# Altium schematic sheet frontend.SchDoc
size B
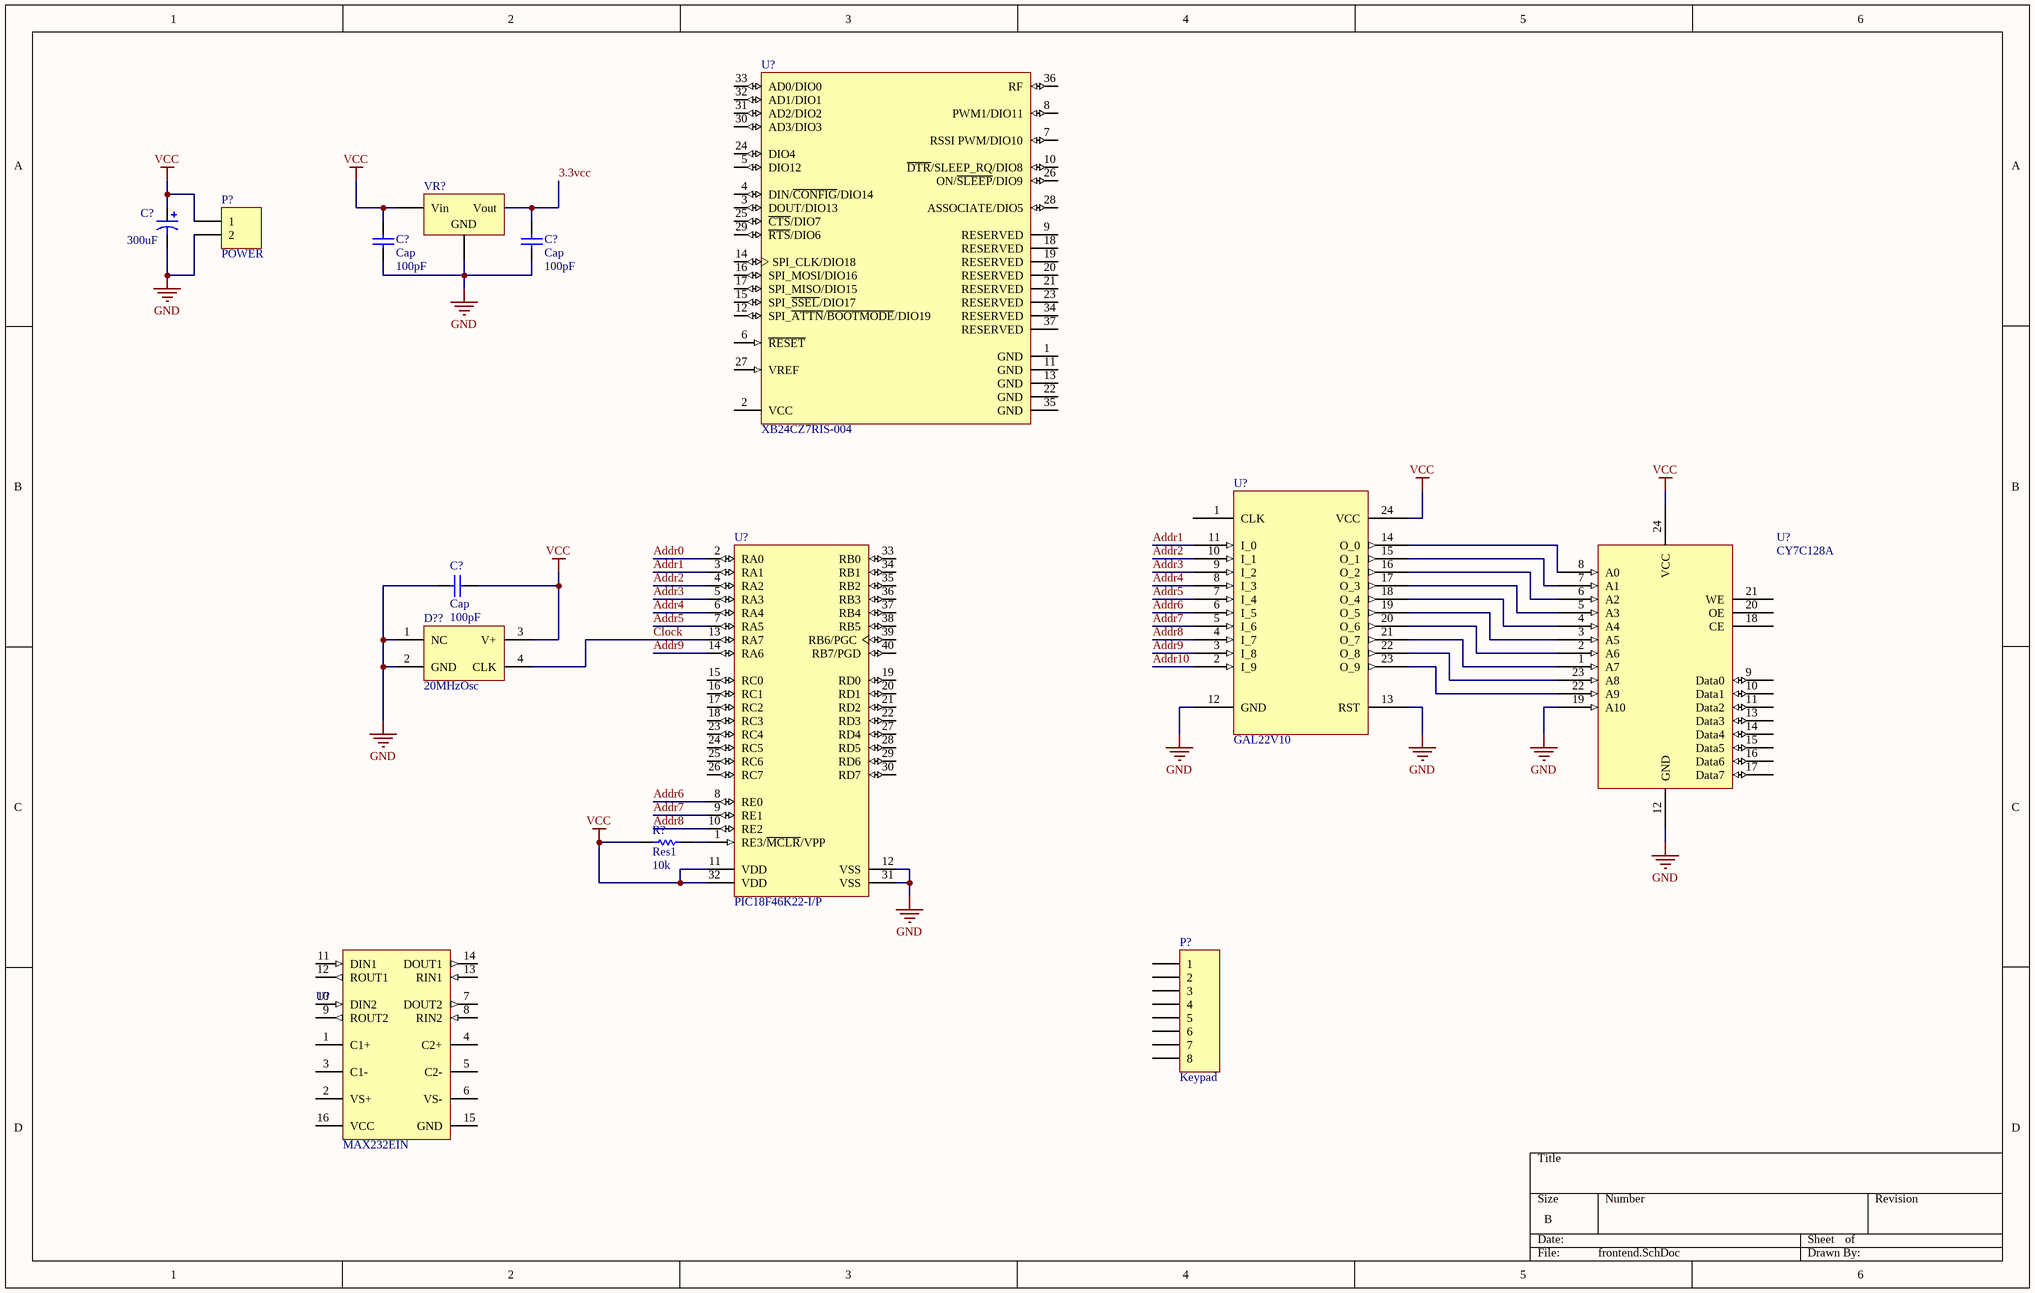
[diagram p0: frontend.SchDoc]

## Parts
(Parts that share a designator on the sheet are numbered #1, #2 ... from top to bottom, then left to right.)
C?#1  value 300uF  [RB7.6-15]  (hidden comment: Cap Pol1)
C?#2  Cap  value 100pF  [RAD-0.3]
C?#3  Cap  value 100pF  [RAD-0.3]
C?#4  Cap  value 100pF  [RAD-0.3]
D??  20MHzOsc
P?#1  POWER  [HDR1X2]
P?#2  Keypad  [HDR1X8]
R?  Res1  value 10k  [AXIAL-0.3]
U?#1  XB24CZ7RIS-004  [DIGI-XB24CZ7RIS-004-Module-37_V]
U?#2  PIC18F46K22-I/P  [MCHP-PDIP-P40]
U?#3  GAL22V10
U?#4  CY7C128A
U?#5  MAX232EIN  [TI-N16]
VR?  3.3V LDO  [D2PAK_N]  (value not drawn)

## Nets
GND: C?#1.2 C?#2.2 C?#3.2 C?#4.1 D??.1(NC) D??.2(GND) P?#1.2 U?#2.12(VSS) U?#2.31(VSS) U?#3.12(GND) U?#3.13(RST) U?#4.12(GND) U?#4.19(A10) VR?.2(GND)
VCC: C?#1.1 C?#2.1 C?#4.2 D??.3(V+) P?#1.1 R?.1 U?#2.11(VDD) U?#2.32(VDD) U?#3.24(VCC) U?#4.24(VCC) VR?.1(Vin)
3.3vcc: C?#3.1 VR?.3(Vout)
Addr0: U?#2.2(RA0)
Addr1: U?#2.3(RA1) U?#3.11(I_0)
Addr2: U?#2.4(RA2) U?#3.10(I_1)
Addr3: U?#2.5(RA3) U?#3.9(I_2)
Addr4: U?#2.6(RA4) U?#3.8(I_3)
Addr5: U?#2.7(RA5) U?#3.7(I_4)
Addr6: U?#2.8(RE0) U?#3.6(I_5)
Addr7: U?#2.9(RE1) U?#3.5(I_6)
Addr8: U?#2.10(RE2) U?#3.4(I_7)
Addr9: U?#2.14(RA6) U?#3.3(I_8)
Addr10: U?#3.2(I_9)
Clock: D??.4(CLK) U?#2.13(RA7)
NetR?_2: R?.2 U?#2.1(RE3/~{MCLR}/VPP)
NetU?#3_14: U?#3.14(O_0) U?#4.8(A0)
NetU?#3_15: U?#3.15(O_1) U?#4.7(A1)
NetU?#3_16: U?#3.16(O_2) U?#4.6(A2)
NetU?#3_17: U?#3.17(O_3) U?#4.5(A3)
NetU?#3_18: U?#3.18(O_4) U?#4.4(A4)
NetU?#3_19: U?#3.19(O_5) U?#4.3(A5)
NetU?#3_20: U?#3.20(O_6) U?#4.2(A6)
NetU?#3_21: U?#3.21(O_7) U?#4.1(A7)
NetU?#3_22: U?#3.22(O_8) U?#4.23(A8)
NetU?#3_23: U?#3.23(O_9) U?#4.22(A9)

Not connected (* = marked no-connect by the designer): P?#2 1 2 3 4 5 6 7 8; U?#1 1(GND) 2(VCC) 3(DOUT/DIO13) 4(DIN/~{CONFIG}/DIO14) 5(DIO12) 6(~{RESET}) 7(RSSI_PWM/DIO10) 8(PWM1/DIO11) 9(RESERVED) 10(~{DTR}/SLEEP_RQ/DIO8) 11(GND) 12(SPI_~{ATTN}/~{BOOTMODE}/DIO19) 13(GND) 14(SPI_CLK/DIO18) 15(SPI_~{SSEL}/DIO17) 16(SPI_MOSI/DIO16) 17(SPI_MISO/DIO15) 18(RESERVED) 19(RESERVED) 20(RESERVED) 21(RESERVED) 22(GND) 23(RESERVED) 24(DIO4) 25(~{CTS}/DIO7) 26(ON/~{SLEEP}/DIO9) 27(VREF) 28(ASSOCIATE/DIO5) 29(~{RTS}/DIO6) 30(AD3/DIO3) 31(AD2/DIO2) 32(AD1/DIO1) 33(AD0/DIO0) 34(RESERVED) 35(GND) 36(RF) 37(RESERVED); U?#2 15(RC0) 16(RC1) 17(RC2) 18(RC3) 19(RD0) 20(RD1) 21(RD2) 22(RD3) 23(RC4) 24(RC5) 25(RC6) 26(RC7) 27(RD4) 28(RD5) 29(RD6) 30(RD7) 33(RB0) 34(RB1) 35(RB2) 36(RB3) 37(RB4) 38(RB5) 39(RB6/PGC) 40(RB7/PGD); U?#3 1(CLK); U?#4 9(Data0) 10(Data1) 11(Data2) 13(Data3) 14(Data4) 15(Data5) 16(Data6) 17(Data7) 18(CE) 20(OE) 21(WE); U?#5 1(C1+) 2(VS+) 3(C1-) 4(C2+) 5(C2-) 6(VS-) 7(DOUT2) 8(RIN2) 9(ROUT2) 10(DIN2) 11(DIN1) 12(ROUT1) 13(RIN1) 14(DOUT1) 15(GND) 16(VCC)

## Library data of the parts
C?#1 = Cap Pol1: Polarized Capacitor (Radial); Published: 8-Jun-2000; LatestRevisionDate: 17-Jul-2002; LatestRevisionNote: Re-released for DXP Platform.; PackageReference: RB7.6-15; Publisher: Altium Limited; PackageDescription: Polarized Capacitor (Radial); 2 Leads
C?#2-C?#4 = Cap: Capacitor; Published: 8-Jun-2000; LatestRevisionDate: 17-Jul-2002; LatestRevisionNote: Re-released for DXP Platform.; PackageReference: RAD-0.3; Publisher: Altium Limited; PackageDescription: Radial Cap, Thru-Hole; 2 Leads; 0.3 in Pin Spacing
D?? = Osc1: 20MHz Crystal Oscillator; Published: 24-Mar-1999; LatestRevisionDate: 17-Jul-2002; LatestRevisionNote: Re-released for DXP Platform.; PackageReference: D-46_6A; Publisher: Altium Limited; PackageDescription: Bridge Rectifier; 4 Terminals; Body 16.8 x 16.8 mm (typ); Pitch 10.67 mm
P?#1 = Header 2: Header, 2-Pin; LatestRevisionDate: 17-Jul-2002; LatestRevisionNote: Re-released for DXP Platform.; Publisher: Altium Limited
P?#2 = Header 8: Header, 8-Pin; LatestRevisionDate: 17-Jul-2002; LatestRevisionNote: Re-released for DXP Platform.; Publisher: Altium Limited
R? = Res1: Resistor; Published: 8-Jun-2000; LatestRevisionDate: 17-Jul-2002; LatestRevisionNote: Re-released for DXP Platform.; PackageReference: AXIAL-0.3; Publisher: Altium Limited; PackageDescription: Axial Device, Thru-Hole; 2 Leads; 0.3 in Pin Spacing
U?#1 = CMP-0009-00001-1: XBee ZB SMT RF Module, 2.4 GHz, 250 kbps, -100 dBm, 2.1 to 3.6 V, 28 mA, 3.1 mW, -40 to 85 degC, 37-Pin Module, RoHS; Manufacturer: Digi international; Operating Current (Receive): 28 mA; Transmit Power Output: 3.1 mW; Indoor/Urban Range: Up to 200 ft. (60 m); RF Data Rate: 250000 bps; Operating Frequency Band: ISM 2.4 to 2.5 GHz; Outdoor RF line-of-sight Range: Up to 4000 ft. (1200 m); Operating Temperature: -40 to 85 degC; Supply Voltage: 2.1 to 3.6 V; ComponentLink3URL: http://ftp1.digi.com/support/documentation/90002002_K.pdf; ROHS: TRUE; PackageDescription: 37-Pin Module, Body 21.996 x 33.782 mm, Pitch 2.007 mm; PackageReference: XB24CZ7RIS-004-Module-37; DatasheetVersion: Sep-13; ComponentLink3Description: Package Specification; Receiver Sensitivity: -100 dBm; ComponentLink2URL: http://ftp1.digi.com/support/documentation/90002002_K.pdf; PartNumber: XB24CZ7RIS-004; Mounting Technology: Surface Mount; ComponentLink1Description: Manufacturer URL; ComponentLink2Description: Datasheet; PackageVersion: 6/9/2013; ComponentLink1URL: http://www.digi.com/
U?#2 = CMP-0116-01389-1: Low-Power, High-Performance Microcontroller with XLP Technology, 64 MHz, 35 I/O, -40 to 85 degC, 40-pin PDIP (P40), Tube; Manufacturer: Microchip; # of A/D Channels: 28; RAM: 3896; I/O Pins: 35; Program Memory KWords: 32; Memory Type: Flash; Max. CPU Speed MHz: 64; Operation Voltage Range: 2.3V - 5.5V; Timers: 3 - 8-bit, 4 - 16-bit; Internal Oscillator: 16 MHz, 31 kHz; EEPROM Data Memory (bytes): 1024; Digital Communication: 2 -A/E/USART, 2 -MSSP(SPI/I2C); Packing: TUBE; ComponentLink2Description: Package Specification; ComponentLink3URL: Product URL:http://www.microchip.com/datasheet/PIC18F46K22; ComponentLink1URL: http://ww1.microchip.com/downloads/en/DeviceDoc/41412F.pdf; PackageReference: PDIP-P40; PackageDescription: 40-Lead Plastic Dual In-Line Package, Body 51.75 x 13.53 mm, Pitch 2.54 mm; Mounting Technology: Through Hole; ComponentLink1Description: Datasheet; ComponentLink2URL: http://www.microchip.com/stellent/groups/techpub_sg/documents/packagingspec/en012702.pdf; PartNumber: PIC18F46K22-I/P; ComponentLink3Description: URL Link1; Program Memory KBytes: 64; PackageVersion: C04-016B, 04/2013; DatasheetVersion: Rev. F; RoHS: TRUE
U?#4 = CY7C128A: 2k x 8 SRAM
U?#5 = CMP-0299-00016-1: Dual RS-232 Driver / Receiver with IEC61000-4-2 Protection, -40 to 85 degC, 16-Pin PDIP (N),  Pb-Free (RoHS); Drivers Per Package: 2; Supply Voltage(s)(V): 5; ICC(Max)(mA): 10; RS-232: TRUE; ESD HBM(kV): +/-15; DatasheetVersion: SLLS723B; PackageDescription: 16-Pin Plastic Dual-In-Line Package, Row Spacing 7.62 mm, Pitch 2.54 mm; ComponentLink2Description: Datasheet; PackageVersion: revE, Dec-2002; ComponentLink1Description: Manufacturer URL; ComponentLink3Description: Package Specification; ComponentLink3URL: http://www.ti.com/litv/pdf/mpdi002c; Receivers Per Package: 2; PackageReference: N16; SubFamily: RS-232; ComponentLink1URL: www.ti.com; IEC-61000-4-2 SUPPORT: TRUE; ComponentLink2URL: http://www.ti.com/general/docs/lit/getliterature.tsp?genericPartNumber=MAX232E&fileType=pdf; Single Supply: TRUE
VR? = Volt Reg: Voltage Regulator; Published: 24-Mar-1999; LatestRevisionDate: 29-May-2009; LatestRevisionNote: IPC-7351 Footprint Added.; PackageReference: D2PAK; Publisher: Altium Limited; PackageDescription: 3-Pin Transistor Outline Package 2.54 mm Pitch, 15.1 mm Lead Span